# Altium schematic sheet Interface.SchDoc
size A4
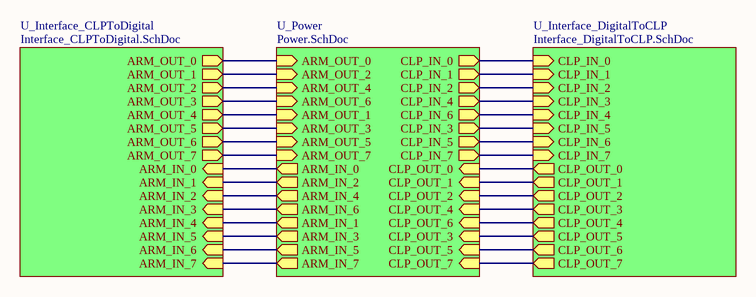
[diagram p0: Interface.SchDoc]

## Sub-sheets
U_Interface_CLPToDigital = Interface_CLPToDigital.SchDoc: ARM_IN_0 (in), ARM_IN_1 (in), ARM_IN_2 (in), ARM_IN_3 (in), ARM_IN_4 (in), ARM_IN_5 (in), ARM_IN_6 (in), ARM_IN_7 (in), ARM_OUT_0 (out), ARM_OUT_1 (out), ARM_OUT_2 (out), ARM_OUT_3 (out), ARM_OUT_4 (out), ARM_OUT_5 (out), ARM_OUT_6 (out), ARM_OUT_7 (out)
U_Interface_DigitalToCLP = Interface_DigitalToCLP.SchDoc: CLP_IN_0 (in), CLP_OUT_0 (out), CLP_IN_1 (in), CLP_OUT_1 (out), CLP_IN_2 (in), CLP_OUT_2 (out), CLP_IN_3 (in), CLP_OUT_3 (out), CLP_IN_4 (in), CLP_OUT_4 (out), CLP_IN_5 (in), CLP_OUT_5 (out), CLP_IN_6 (in), CLP_OUT_6 (out), CLP_IN_7 (in), CLP_OUT_7 (out)
U_Power = Power.SchDoc: CLP_IN_0 (out), CLP_IN_1 (out), CLP_IN_2 (out), CLP_IN_4 (out), CLP_IN_6 (out), CLP_IN_3 (out), CLP_IN_5 (out), CLP_IN_7 (out), CLP_OUT_0 (in), CLP_OUT_1 (in), CLP_OUT_2 (in), CLP_OUT_4 (in), CLP_OUT_6 (in), CLP_OUT_3 (in), CLP_OUT_5 (in), CLP_OUT_7 (in), ARM_IN_0 (out), ARM_OUT_0 (in), ARM_OUT_2 (in), ARM_OUT_4 (in), ARM_OUT_6 (in), ARM_OUT_1 (in), ARM_OUT_3 (in), ARM_OUT_5 (in), ARM_OUT_7 (in), ARM_IN_2 (out), ARM_IN_4 (out), ARM_IN_6 (out), ARM_IN_1 (out), ARM_IN_3 (out), ARM_IN_5 (out), ARM_IN_7 (out)

## Nets
(unnamed): sheet U_Power/CLP_IN_0, sheet U_Interface_DigitalToCLP/CLP_IN_0
(unnamed): sheet U_Power/CLP_IN_1, sheet U_Interface_DigitalToCLP/CLP_IN_1
(unnamed): sheet U_Power/CLP_IN_2, sheet U_Interface_DigitalToCLP/CLP_IN_2
(unnamed): sheet U_Power/CLP_IN_4, sheet U_Interface_DigitalToCLP/CLP_IN_3
(unnamed): sheet U_Power/CLP_IN_6, sheet U_Interface_DigitalToCLP/CLP_IN_4
(unnamed): sheet U_Power/CLP_IN_3, sheet U_Interface_DigitalToCLP/CLP_IN_5
(unnamed): sheet U_Power/CLP_IN_5, sheet U_Interface_DigitalToCLP/CLP_IN_6
(unnamed): sheet U_Power/CLP_IN_7, sheet U_Interface_DigitalToCLP/CLP_IN_7
(unnamed): sheet U_Power/CLP_OUT_0, sheet U_Interface_DigitalToCLP/CLP_OUT_0
(unnamed): sheet U_Power/CLP_OUT_1, sheet U_Interface_DigitalToCLP/CLP_OUT_1
(unnamed): sheet U_Power/CLP_OUT_2, sheet U_Interface_DigitalToCLP/CLP_OUT_2
(unnamed): sheet U_Power/CLP_OUT_4, sheet U_Interface_DigitalToCLP/CLP_OUT_3
(unnamed): sheet U_Power/CLP_OUT_6, sheet U_Interface_DigitalToCLP/CLP_OUT_4
(unnamed): sheet U_Power/CLP_OUT_3, sheet U_Interface_DigitalToCLP/CLP_OUT_5
(unnamed): sheet U_Power/CLP_OUT_5, sheet U_Interface_DigitalToCLP/CLP_OUT_6
(unnamed): sheet U_Power/CLP_OUT_7, sheet U_Interface_DigitalToCLP/CLP_OUT_7
(unnamed): sheet U_Power/ARM_IN_0, sheet U_Interface_CLPToDigital/ARM_IN_0
(unnamed): sheet U_Power/ARM_OUT_0, sheet U_Interface_CLPToDigital/ARM_OUT_0
(unnamed): sheet U_Power/ARM_OUT_2, sheet U_Interface_CLPToDigital/ARM_OUT_1
(unnamed): sheet U_Power/ARM_OUT_4, sheet U_Interface_CLPToDigital/ARM_OUT_2
(unnamed): sheet U_Power/ARM_OUT_6, sheet U_Interface_CLPToDigital/ARM_OUT_3
(unnamed): sheet U_Power/ARM_OUT_1, sheet U_Interface_CLPToDigital/ARM_OUT_4
(unnamed): sheet U_Power/ARM_OUT_3, sheet U_Interface_CLPToDigital/ARM_OUT_5
(unnamed): sheet U_Power/ARM_OUT_5, sheet U_Interface_CLPToDigital/ARM_OUT_6
(unnamed): sheet U_Power/ARM_OUT_7, sheet U_Interface_CLPToDigital/ARM_OUT_7
(unnamed): sheet U_Power/ARM_IN_2, sheet U_Interface_CLPToDigital/ARM_IN_1
(unnamed): sheet U_Power/ARM_IN_4, sheet U_Interface_CLPToDigital/ARM_IN_2
(unnamed): sheet U_Power/ARM_IN_6, sheet U_Interface_CLPToDigital/ARM_IN_3
(unnamed): sheet U_Power/ARM_IN_1, sheet U_Interface_CLPToDigital/ARM_IN_4
(unnamed): sheet U_Power/ARM_IN_3, sheet U_Interface_CLPToDigital/ARM_IN_5
(unnamed): sheet U_Power/ARM_IN_5, sheet U_Interface_CLPToDigital/ARM_IN_6
(unnamed): sheet U_Power/ARM_IN_7, sheet U_Interface_CLPToDigital/ARM_IN_7